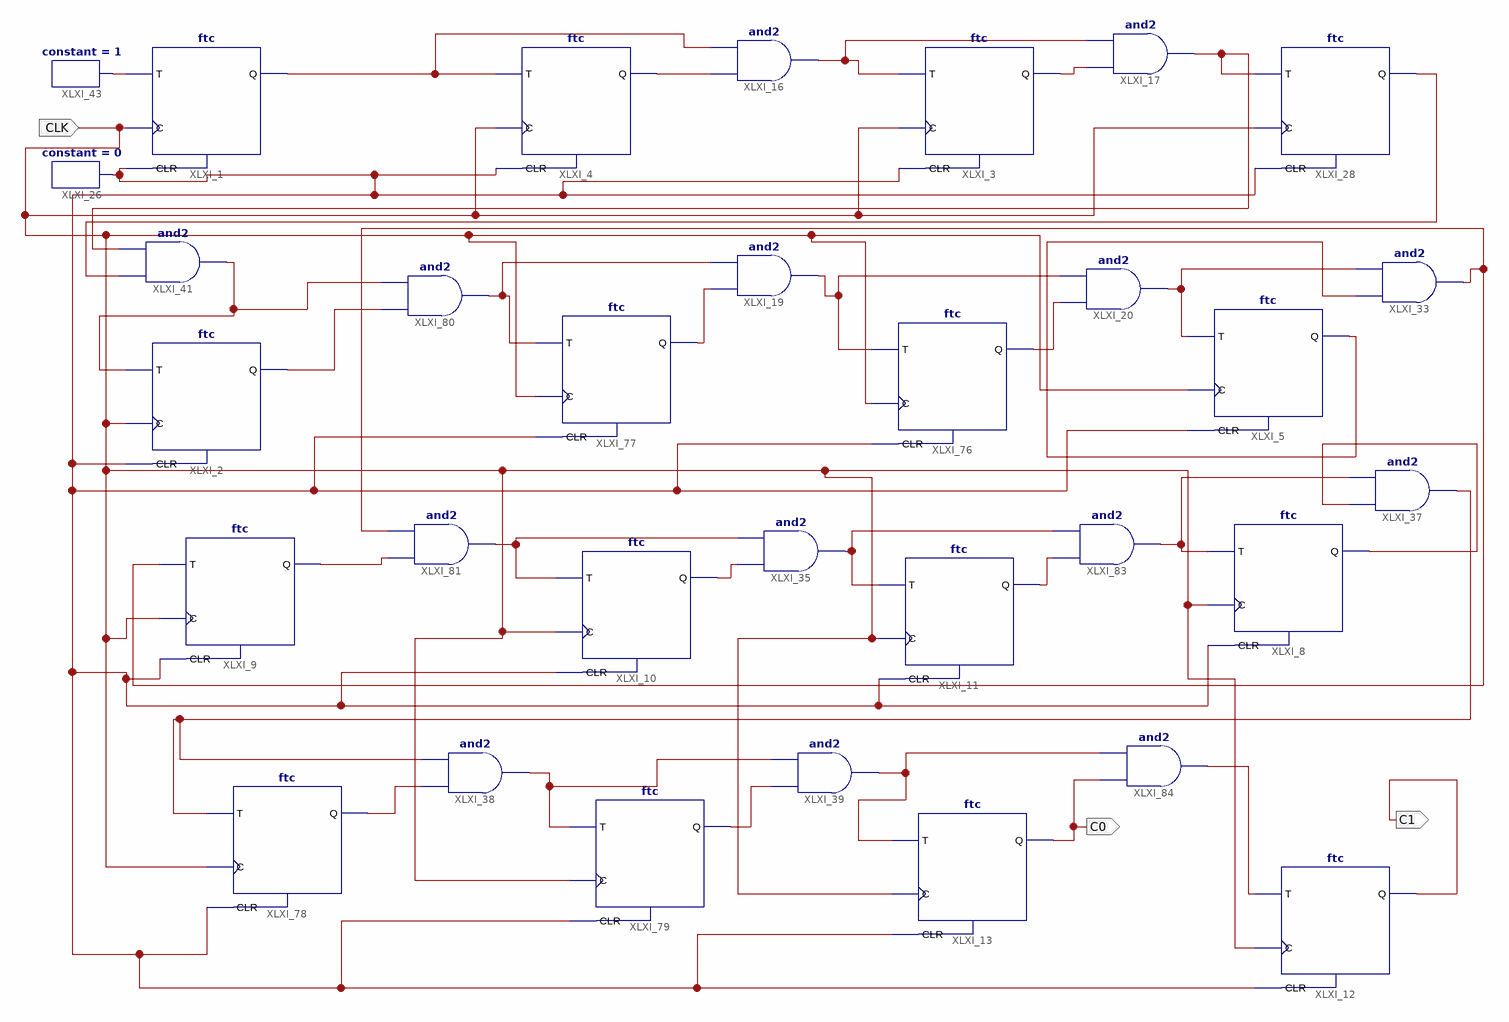
[diagram p0: schematic sheet 1]
// Xilinx ISE schematic tim_circuit.sch (spartan6) as structural Verilog: 32 symbols, 3 ports
module tim_circuit (
  input  CLK,
  output C1,
  output C0
);

  wire XLXN_9, XLXN_10, XLXN_11, XLXN_12, XLXN_14, XLXN_18, XLXN_19, XLXN_58, XLXN_61, XLXN_64, XLXN_65,
       XLXN_67, XLXN_69, XLXN_74, XLXN_75, XLXN_77, XLXN_78, XLXN_81, XLXN_82, XLXN_84, XLXN_85, XLXN_86,
       XLXN_87, XLXN_90, XLXN_93, XLXN_94, XLXN_106, XLXN_188, XLXN_190, XLXN_192;

  ftc XLXI_1 (.C(CLK), .CLR(XLXN_9), .T(XLXN_106), .Q(XLXN_10));
  ftc XLXI_2 (.C(CLK), .CLR(XLXN_9), .T(XLXN_18), .Q(XLXN_19));
  ftc XLXI_3 (.C(CLK), .CLR(XLXN_9), .T(XLXN_192), .Q(XLXN_12));
  ftc XLXI_4 (.C(CLK), .CLR(XLXN_9), .T(XLXN_10), .Q(XLXN_11));
  ftc XLXI_5 (.C(CLK), .CLR(XLXN_9), .T(XLXN_67), .Q(XLXN_69));
  ftc XLXI_8 (.C(CLK), .CLR(XLXN_9), .T(XLXN_85), .Q(XLXN_84));
  ftc XLXI_9 (.C(CLK), .CLR(XLXN_9), .T(XLXN_75), .Q(XLXN_74));
  ftc XLXI_10 (.C(CLK), .CLR(XLXN_9), .T(XLXN_78), .Q(XLXN_77));
  ftc XLXI_11 (.C(CLK), .CLR(XLXN_9), .T(XLXN_81), .Q(XLXN_82));
  ftc XLXI_12 (.C(CLK), .CLR(XLXN_9), .T(XLXN_94), .Q(C1));
  ftc XLXI_13 (.C(CLK), .CLR(XLXN_9), .T(XLXN_93), .Q(C0));
  and XLXI_16 (XLXN_192, XLXN_11, XLXN_10);
  and XLXI_17 (XLXN_14, XLXN_12, XLXN_192);
  and XLXI_19 (XLXN_64, XLXN_61, XLXN_190);
  and XLXI_20 (XLXN_67, XLXN_65, XLXN_64);
  and XLXI_35 (XLXN_81, XLXN_77, XLXN_78);
  and XLXI_37 (XLXN_86, XLXN_84, XLXN_85);
  and XLXI_38 (XLXN_188, XLXN_87, XLXN_86);
  and XLXI_39 (XLXN_93, XLXN_90, XLXN_188);
  and XLXI_41 (XLXN_18, XLXN_58, XLXN_14);
  ftc XLXI_28 (.C(CLK), .CLR(XLXN_9), .T(XLXN_14), .Q(XLXN_58));
  and XLXI_33 (XLXN_75, XLXN_69, XLXN_67);
  constant #(.CValue("0")) XLXI_26 (.O(XLXN_9));
  constant #(.CValue("1")) XLXI_43 (.O(XLXN_106));
  ftc XLXI_76 (.C(CLK), .CLR(XLXN_9), .T(XLXN_64), .Q(XLXN_65));
  ftc XLXI_77 (.C(CLK), .CLR(XLXN_9), .T(XLXN_190), .Q(XLXN_61));
  ftc XLXI_78 (.C(CLK), .CLR(XLXN_9), .T(XLXN_86), .Q(XLXN_87));
  ftc XLXI_79 (.C(CLK), .CLR(XLXN_9), .T(XLXN_188), .Q(XLXN_90));
  and XLXI_80 (XLXN_190, XLXN_19, XLXN_18);
  and XLXI_81 (XLXN_78, XLXN_74, XLXN_75);
  and XLXI_83 (XLXN_85, XLXN_82, XLXN_81);
  and XLXI_84 (XLXN_94, C0, XLXN_93);
endmodule
